# EAGLE design GPS_Tracker (EAGLE 6.5.0)
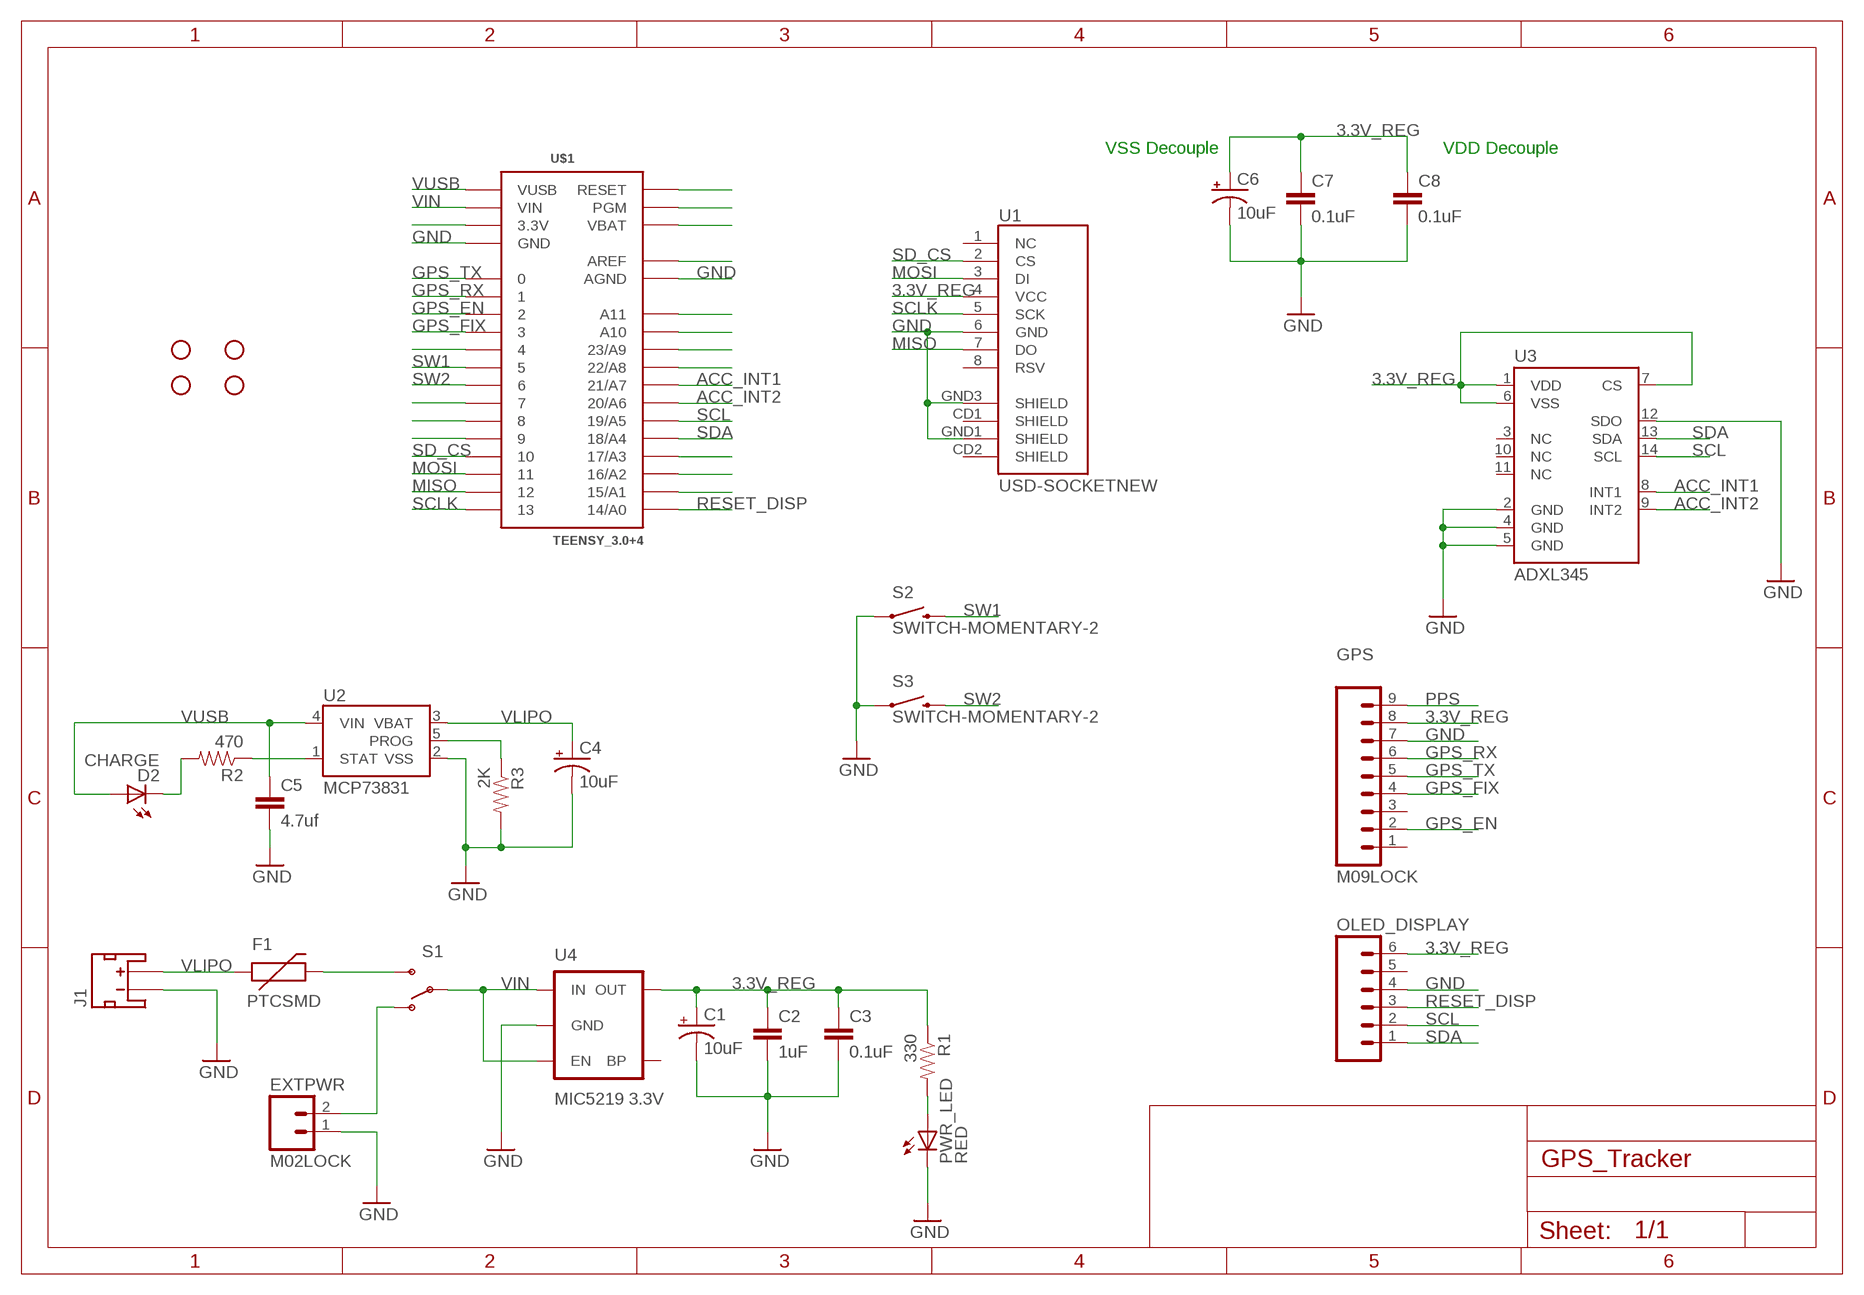
[diagram p0: schematic, sheet 1]

## Parts
C1  10uF  CAP_POL1206  [EIA3216]
C2  1uF  CAP0402-CAP  [0402-CAP]
C3  0.1uF  CAP0402-CAP  [0402-CAP]
C4  10uF  CAP_POL1206  [EIA3216]
C5  4.7uf  CAP0402-CAP  [0402-CAP]
C6  10uF  CAP_POL1206  [EIA3216]
C7  0.1uF  CAP0402-CAP  [0402-CAP]
C8  0.1uF  CAP0402-CAP  [0402-CAP]
D2  CHARGE  LED-YELLOW0603  [LED-0603]
EXTPWR  M02LOCK  [1X02_LOCK]
F1  PTCSMD  [PTC-1206]
GPS  M09LOCK  [1X09_LOCK]
J1  JST_2MM_MALE  [JST-2-SMD]
OLED_DISPLAY  M06LOCK  [1X06_LOCK]
PWR_LED  RED  LED-RED0603  [LED-0603]
R1  330  RESISTOR0402-RES  [0402-RES]
R2  470  RESISTOR0402-RES  [0402-RES]
R3  2K  RESISTOR0402-RES  [0402-RES]
S1  SWITCH-SPDTSMD  [AYZ0202]
S2  SWITCH-MOMENTARY-2  [TACTILE_SWITCH_TALL]
S3  SWITCH-MOMENTARY-2  [TACTILE_SWITCH_TALL]
STANDOFF1  STAND-OFF  [STAND-OFF]
STANDOFF2  STAND-OFF  [STAND-OFF]
STANDOFF3  STAND-OFF  [STAND-OFF]
STANDOFF4  STAND-OFF  [STAND-OFF]
U1  USD-SOCKETNEW  [MICRO-SD-SOCKET-PP]
U2  MCP73831  [SOT23-5]
U3  ADXL345  [LGA14]
U4  MIC5219 3.3V  V_REG_MIC52193.3V  [SOT23-5]
U$1  TEENSY_3.0+4  [TEENSY_3.0+4]

## Nets
3.3V_REG: C1.A(+) C2.1 C3.1 C6.A(+) C7.1 C8.1 GPS.8 OLED_DISPLAY.6 R1.1 U1.4(VCC) U3.1(VDD) U3.6(VSS) U3.7(CS) U4.5(OUT)
ACC_INT1: U3.8(INT1) U$1.21/A7
ACC_INT2: U3.9(INT2) U$1.20/A6
GND: C1.C(-) C2.2 C3.2 C4.C(-) C5.2 C6.C(-) C7.2 C8.2 EXTPWR.1 GPS.7 J1.1(-) OLED_DISPLAY.4 PWR_LED.C R3.2 S2.A2 S3.A2 U1.6(GND) U1.GND1(SHIELD) U1.GND3(SHIELD) U2.2(VSS) U3.2(GND) U3.4(GND) U3.5(GND) U3.12(SDO) U4.2(GND) U$1.AGND U$1.GND U$1.GND1(GND)
GPS_EN: GPS.2 U$1.2
GPS_FIX: GPS.4 U$1.3
GPS_RX: GPS.6 U$1.1
GPS_TX: GPS.5 U$1.0
MISO: U1.7(DO) U$1.12
MOSI: U1.3(DI) U$1.11
N$1: D2.C R2.2
N$2: F1.2 S1.3(S)
N$3: EXTPWR.2 S1.1(O)
N$4: U$1.3.3V U$1.3.3V1(3.3V)
N$6: PWR_LED.A R1.2
N$7: R2.1 U2.1(STAT)
N$9: R3.1 U2.5(PROG)
N$13: U$1.4
N$16: U$1.7
N$17: U$1.8
N$18: U$1.9
N$24: U$1.15/A1
N$25: U$1.16/A2
N$26: U$1.17/A3
N$31: U$1.22/A8
N$32: U$1.23/A9
N$33: U$1.A10
N$34: U$1.A11
N$36: U$1.AREF
N$37: U$1.VBAT
N$38: U$1.PGM
N$39: U$1.RESET
PPS: GPS.9
RESET_DISP: OLED_DISPLAY.3 U$1.14/A0
SCL: OLED_DISPLAY.2 U3.14(SCL) U$1.19/A5
SCLK: U1.5(SCK) U$1.13
SD_CS: U1.2(CS) U$1.10
SDA: OLED_DISPLAY.1 U3.13(SDA) U$1.18/A4
SW1: S2.B2 U$1.5
SW2: S3.B2 U$1.6
VIN: S1.2(P) U4.1(IN) U4.3(EN) U$1.VIN
VLIPO: C4.A(+) F1.1 J1.2(+) U2.3(VBAT)
VUSB: C5.1 D2.A U2.4(VIN) U$1.VUSB
Unconnected: GPS.1 GPS.3 J1.NC1(PAD1) J1.NC2(PAD2) OLED_DISPLAY.5 U1.1(NC) U1.8(RSV) U1.CD1(SHIELD) U1.CD2(SHIELD) U3.3(NC) U3.10(NC) U3.11(NC) U4.4(BP)

## Notes on the sheet
- VSS Decouple | VDD Decouple

## Library data of the parts
C1 C4 C6 = SparkFun-Passives:CAP_POL: Capacitor Polarized These are standard SMD and PTH capacitors. Normally 10uF, 47uF, and 100uF in electrolytic and tantalum varieties. Always verify the external diameter of the through hole cap, it varies with capacity, voltage, and manufacturer. The EIA devices should be standard.
C2 C3 C5 C7 C8 = SparkFun-Passives:CAP: Capacitor Standard 0603 ceramic capacitor, and 0.1" leaded capacitor.
D2 = SparkFun-LED:LED-YELLOW: Yellow SMD LEDs LilyPad 1206- DIO-09909 0603- DIO-09003; PROD_ID: DIO-09003
EXTPWR = SparkFun-Connectors:M02: Standard 2-pin 0.1" header. Use with - straight break away headers ( PRT-00116) - right angle break away headers (PRT-00553) - swiss pins (PRT-00743) - machine pins (PRT-00117) - female headers (PRT-00115) Molex polarized connector foot print use with: PRT-08233 with associated crimp pins and housings. 2.54_SCREWTERM for use with PRT-10571. 3.5mm Screw Terminal footprints for PRT-08084 5mm Screw Terminal footprints for use with PRT-08433
F1 = SparkFun-PowerIC:PTC: Resettable Fuse PTC Resettable Fuse. Spark Fun Electronics SKU : COM-08357; PROD_ID: RES-11150
GPS = SparkFun-Connectors:M09: Header 9 Standard 9-pin 0.1" header. Use with straight break away headers (SKU : PRT-00116), right angle break away headers (PRT-00553), swiss pins (PRT-00743), machine pins (PRT-00117), and female headers (PRT-00115).
J1 = SparkFun-Connectors:JST_2MM_MALE: Mates to single-cell LiPo batteries. CONN-08352; PROD_ID: CONN-08352
OLED_DISPLAY = SparkFun-Connectors:M06: Header 6 Standard 6-pin 0.1" header. Use with straight break away headers (SKU : PRT-00116), right angle break away headers (PRT-00553), swiss pins (PRT-00743), machine pins (PRT-00117), and female headers (PRT-00115). Molex polarized connector foot print use with SKU : PRT-08094 with associated crimp pins and housings. NOTES ON THE VARIANTS LOCK and LOCK_LONGPADS... This footprint was designed to help hold the alignment of a through-hole component (i.e. 6-pin header) while soldering it into place. You may notice that each hole has been shifted either up or down by 0.005 of an inch from it's more standard position (which is a perfectly straight line). This slight alteration caused the pins (the squares in the middle) to touch the edges of the holes. Because they are alternating, it causes a "brace" to hold the component in place. 0.005 has proven to be the perfect amount of "off-center" position when using our standard breakaway headers. Although looks a little odd when you look at the bare footprint, once you have a header in there, the alteration is very hard to notice. Also,if you push a header all the way into place, it is covered up entirely on the bottom side. This idea of altering the position of holes to aid alignment will be further integrated into the Sparkfun Library for other footprints. It can help hold any component with 3 or more connection pins.
PWR_LED = SparkFun-LED:LED-RED: Assorted Red LEDs LilyPad 1206- DIO-09912 1206- DIO-00809 0603- DIO-00819; PROD_ID: DIO-00819
R1-R3 = SparkFun-Passives:RESISTOR: Resistor Basic schematic elements and footprints for 0603, 1206, and PTH resistors.
S1 = SparkFun-Electromechanical:SWITCH-SPDT: SPDT Switch Simple slide switch, Spark Fun Electronics SKU : COM-00102 DPDT SMT slide switch, AYZ0202, SWCH-08179; PROD_ID: SWCH-08179
S2 S3 = SparkFun-Electromechanical:SWITCH-MOMENTARY-2: Various NO switches- pushbuttons, reed, etc
STANDOFF1-STANDOFF4 = SparkFun-Electromechanical:STAND-OFF: #4 Stand Off This is the mechanical footprint for a #4 phillips button head screw. Use the keepout ring to avoid running the screw head into surrounding components. SKU : PRT-00447
U1 = SparkFun-Connectors:USD-SOCKET: microSD Socket Push-push type uSD socket. Schematic element and footprint production proven. Spark Fun Electronics SKU : PRT-00127. tDoc lines correctly indicate media card edge positions when inserting (unlocked, locked, depressed).
U2 = SparkFun-PowerIC:MCP73831: Miniature single cell, fully integrated Li-Ion, Li-polymer charge management controller http://ww1.microchip.com/downloads/en/DeviceDoc/21984a.pdf IC-09995; PROD_ID: IC-09995
U3 = SparkFun-Sensors:ADXL345: 3-axis SPI/I2C 2/4/8/16g accelerometer
U4 = SparkFun-PowerIC:V_REG_MIC5219: V_REG MIC5219 Standard 500mA LDO voltage regulator in SOT-23 layout. Micrel part MIC5219. BP (by-pass) pin is used to lower output noise with 470pF cap, may be left open.; PROD_ID: VREG-09872
U$1 = Teensy3.0:TEENSY_3.0+4: Teensy 3.0 board, showing all pins that are easily acessible. See 'AllAnalogPins" and 'AllPins' packages for additional pin holes, as needed. The 'Basic' package has fewer pins.

## Board
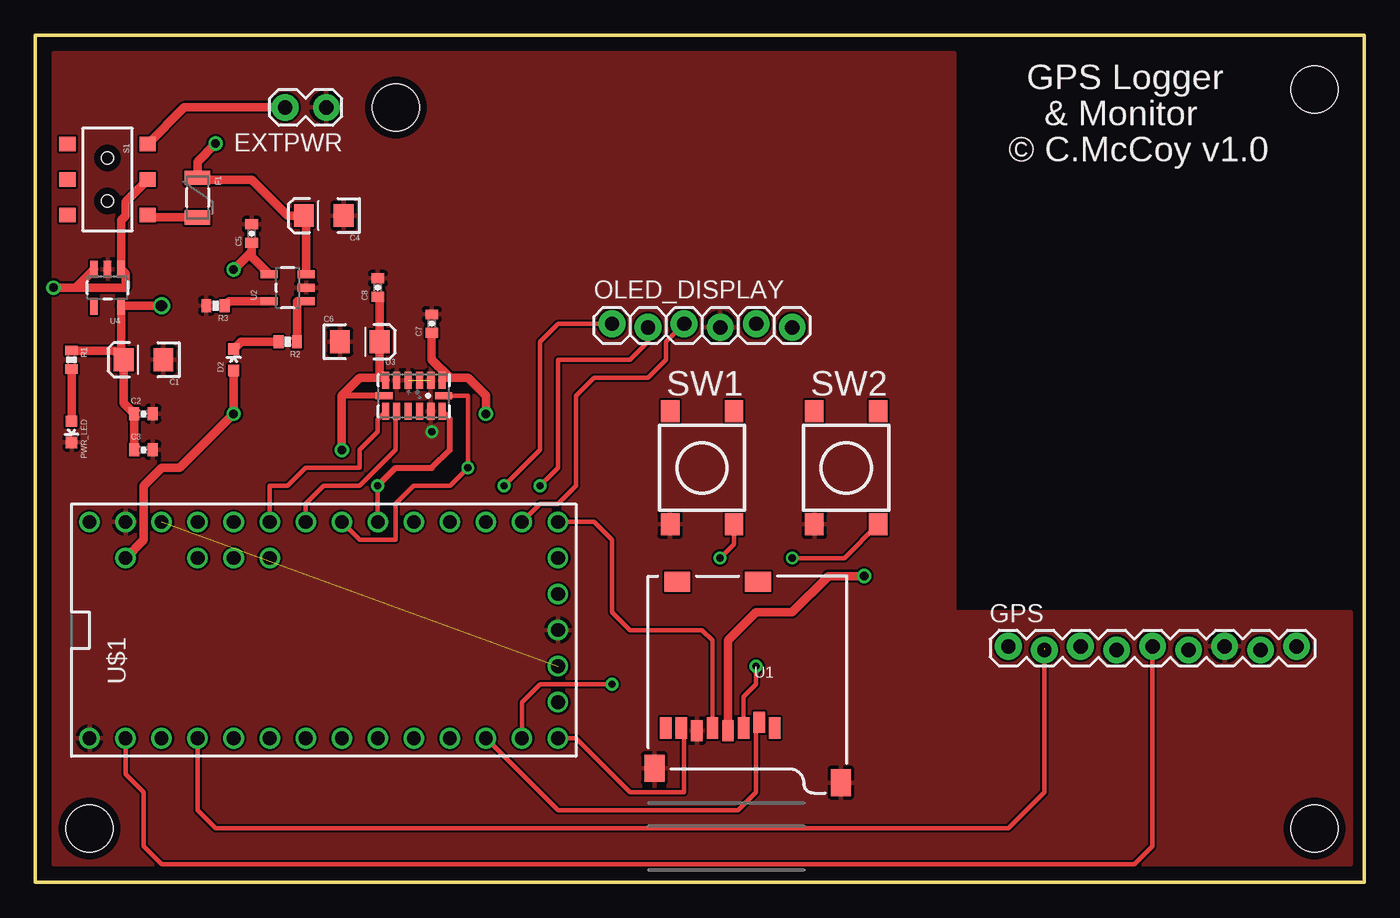
[diagram p1: board, top side]
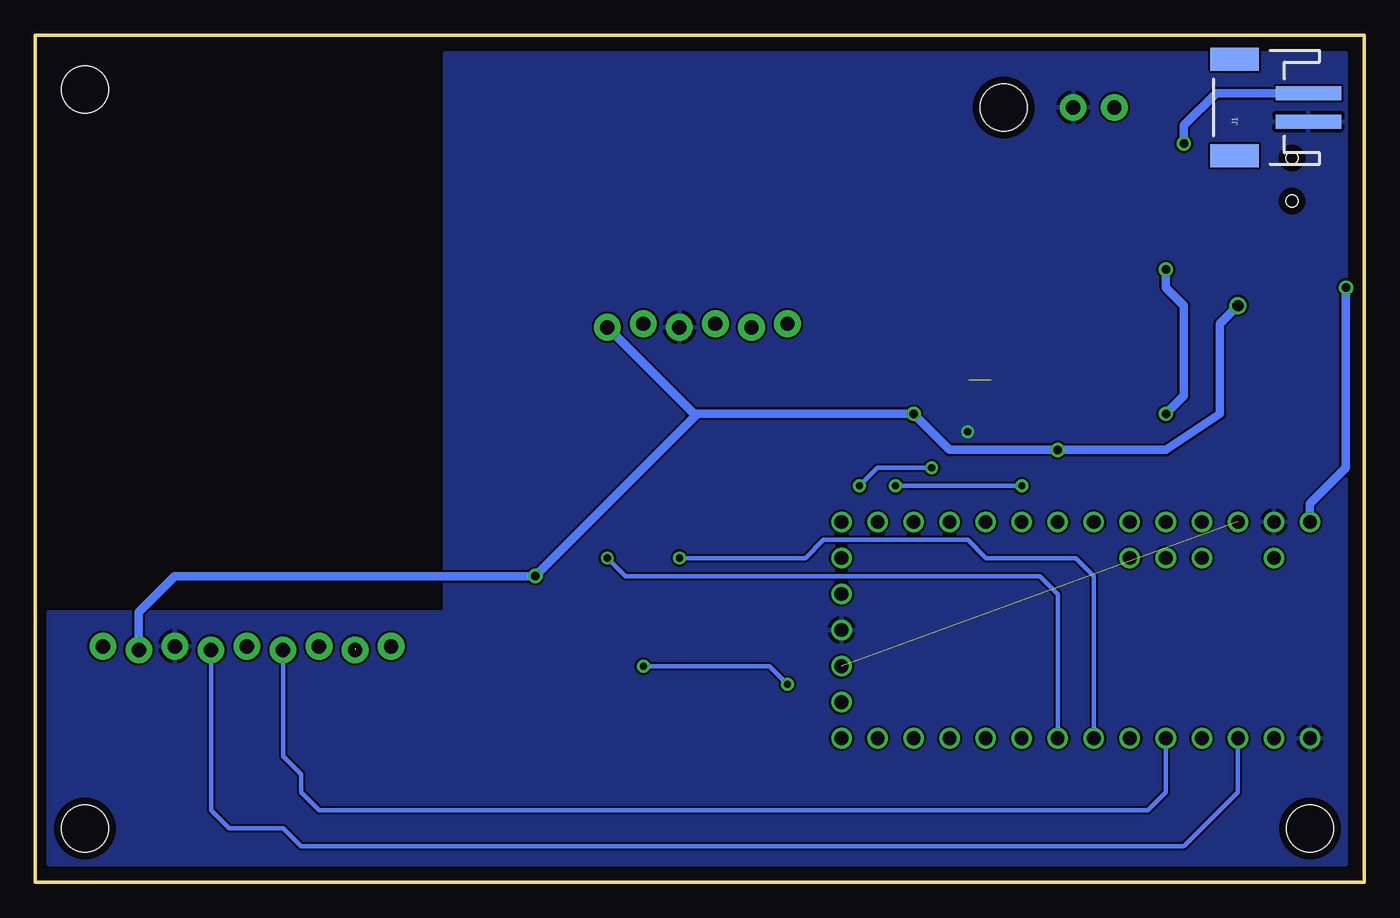
[diagram p2: board, bottom side, seen from below]

Size 93.65 x 59.68 mm. Coordinates in mm from the lower left corner, seen from the top.
Outline: 93.65,0 93.65,59.68 0,59.68 0,0 93.65,0
Copper layers (1*16): Top 0.0178mm / dielectric 59mil / Bottom 0.0178mm
Design rules "SSC-EAGLE-2Lyr_v1.0.0.3": minimum track width 6mil, minimum drill 14mil, track to track 6mil, track to pad 6mil, pad to pad 6mil, via to via 6mil, smd to smd 6mil, copper to edge 20mil, drill to drill 16mil, minimum pad ring 8mil, minimum via ring 8mil, stop-mask expansion 3mil, vias tented up to drill 0mil, thermal gap 10mil
tKeepout: area 66.4,12.7 to 91.4,47.7

### Footprints (pad centres in the part's own frame; a part is rotated, then mirrored left to right if it is on the bottom)
EIA3216 = smd 1.4 x 1.6: A 1.4,0; C -1.4,0
0402-CAP = smd 0.7 x 0.9: 1 -0.65,0; 2 0.65,0
LED-0603 = smd 0.8 x 0.8: A 0,-0.75; C 0,0.75
1X02_LOCK = drill 1.016 pad 1.88: 1 -0.178,0; 2 2.718,0
PTC-1206 = smd 1 x 1.8: 1 -1.4,0; 2 1.4,0
1X09_LOCK = drill 1.016 pad 1.88: 1 0,0.127; 2 2.54,-0.127; 3 5.08,0.127; 4 7.62,-0.127; 5 10.16,0.127; 6 12.7,-0.127; 7 15.24,0.127; 8 17.78,-0.127; 9 20.32,0.127
JST-2-SMD = smd 1 x 4.6: 1 -1,-3.7; 2 1,-3.7 | smd 1.6 x 3.4: NC1 -3.4,1.5; NC2 3.4,1.5
1X06_LOCK = drill 1.016 pad 1.88: 1 0,0; 2 2.54,-0.254; 3 5.08,0; 4 7.62,-0.254; 5 10.16,0; 6 12.7,-0.254
0402-RES = smd 0.7 x 0.9: 1 -0.65,0; 2 0.65,0
AYZ0202 = smd 1 x 1.15: 1 -2.5,2.825; 2 0,2.825; 3 2.5,2.825; 4 -2.5,-2.825; 5 0,-2.825; 6 2.5,-2.825 | hole 0.85: 1.5,0; -1.5,0
TACTILE_SWITCH_TALL = smd 1.55 x 1.3: A1 -3.975,-2.25; A2 3.975,-2.25; B1 -3.975,2.25; B2 3.975,2.25
STAND-OFF = hole 3.302: 0,0
MICRO-SD-SOCKET-PP = smd 0.8 x 1.5: 1 -8.94,10.7; 2 -7.84,10.3; 3 -6.74,10.7; 4 -5.64,10.9; 5 -4.54,10.7; 6 -3.44,10.9; 7 -2.34,10.7; 8 -1.24,10.7 | smd 1.8 x 1.4: CD1 -2.05,0.4; CD2 -7.75,0.4 | smd 1.4 x 1.9: GND1 -13.6,14.55; GND3 -0.45,13.55
SOT23-5 = smd 0.55 x 1.2: 1 -0.95,-1.3; 2 0,-1.3; 3 0.95,-1.3; 4 0.95,1.3; 5 -0.95,1.3
LGA14 = smd 0.5 x 1.2: 1 2,1.1; 2 1.2,1.1; 3 0.4,1.1; 4 -0.4,1.1; 5 -1.2,1.1; 6 -2,1.1; 8 -2,-1.1; 9 -1.2,-1.1; 10 -0.4,-1.1; 11 0.4,-1.1; 12 1.2,-1.1; 13 2,-1.1 | smd 1.2 x 0.5: 7 -2.1,0; 14 2.1,0
TEENSY_3.0+4 = drill 0.965: 0 -7.62,13.97; 1 -7.62,11.43; 2 -7.62,8.89; 3 -7.62,6.35; 3.3V 7.62,11.43; 3.3V1 -2.54,-16.51; 4 -7.62,3.81; 5 -7.62,1.27; 6 -7.62,-1.27; 7 -7.62,-3.81; 8 -7.62,-6.35; 9 -7.62,-8.89; 10 -7.62,-11.43; 11 -7.62,-13.97; 12 -7.62,-16.51; 13 7.62,-16.51; 14/A0 7.62,-13.97; 15/A1 7.62,-11.43; 16/A2 7.62,-8.89; 17/A3 7.62,-6.35; 18/A4 7.62,-3.81; 19/A5 7.62,-1.27; 20/A6 7.62,1.27; 21/A7 7.62,3.81; 22/A8 7.62,6.35; 23/A9 7.62,8.89; A10 5.08,6.35; A11 5.08,3.81; AGND 7.62,13.97; AREF 5.08,8.89; GND -7.62,16.51; GND1 0,-16.51; PGM 2.54,-16.51; RESET 5.08,-16.51; VBAT -5.08,-16.51; VIN 7.62,16.51; VUSB 5.08,13.97

### Placement (x,y rotation side)
C1  7.62,36.83 180 top
C2  7.62,33.02 0 top
C3  7.62,30.48 0 top
C4  20.32,46.99 180 top
C5  15.24,45.72 90 top
C6  22.86,38.1 0 top
C7  27.94,39.37 90 top
C8  24.13,41.91 90 top
D2  13.97,36.83 0 top
EXTPWR  20.32,54.61 180 top
F1  11.43,48.26 270 top
GPS  68.58,16.51 0 top
J1  7.62,54.61 90 bottom
OLED_DISPLAY  40.64,39.37 0 top
PWR_LED  2.54,31.75 180 top
R1  2.54,36.83 270 top
R2  17.78,38.1 180 top
R3  12.7,40.64 180 top
S1  5.08,49.53 270 top
S2  46.99,29.21 270 top
S3  57.15,29.21 270 top
STANDOFF1  3.81,3.81 0 top
STANDOFF2  90.17,55.88 0 top
STANDOFF3  90.17,3.81 0 top
STANDOFF4  25.4,54.61 0 top
U1  43.18,21.59 180 top
U2  17.78,41.91 90 top
U3  26.67,34.29 0 top
U4  5.08,41.91 180 top
U$1  20.32,17.78 90 top

### Tracks (layer width: path | path; a pad name or v marks a point on that pad's centre or on a via)
3.3V_REG  (via drill 0.6, 0.8)
  Top 0.406: U3.7 21.59,34.29
  Top 0.61: C1.A 6.03,37.02 U4.5 6.06,40.64 v8.89,40.64 | R1.1 5.57,37.48 C1.A | C1.A 6.22,33.77 C2.1 C3.1 | v21.59,30.48 21.59,34.29 22.86,35.56 24.26,35.56 | U3.6 24.5,35.56 24.26,35.56 | 29.21,35.56 30.48,35.56 31.75,34.29 v31.75,33.02 | 29.21,35.56 28.84,35.56 U3.1 | v58.42,21.59 55.88,21.59 53.34,19.05 50.8,19.05 48.82,17.07 U1.4 | C7.1 27.94,36.83 29.21,35.56 | 24.26,35.56 C6.A 24.26,41.26 C8.1
  Bottom 0.61: v8.89,40.64 10.16,39.37 10.16,33.02 13.97,30.48 v21.59,30.48 29.21,30.48 v31.75,33.02 46.99,33.02 | 46.99,33.02 47.24,33.02 OLED_DISPLAY.6 | GPS.8 86.36,19.05 83.82,21.59 v58.42,21.59 46.99,33.02
ACC_INT1
  Top 0.305: U$1.21/A7 16.51,27.94 17.78,27.94 19.05,29.21 22.86,29.21 22.86,30.48 24.13,31.75 24.13,32.65 U3.8
ACC_INT2
  Top 0.305: U$1.20/A6 19.05,26.67 20.32,27.94 22.86,27.94 25.4,30.48 25.4,33.12 U3.9
GND  (via drill 0.5)  (1 unrouted)
  other vias: 27.94,31.75
  pour Bottom: 1.27,58.42 64.77,58.42 64.77,19.05 92.71,19.05 92.71,1.27 1.27,1.27
  pour Top: 1.27,58.42 64.77,58.42 64.77,19.05 91.44,19.05 92.71,19.05 92.71,1.27 1.27,1.27
GPS_EN  (1 unrouted)
  Top 0.305: U$1.2 11.43,5.08 12.7,3.81 68.58,3.81 71.12,6.35 71.12,16.51
GPS_FIX
  Bottom 0.305: U$1.3 13.97,6.35 15.24,5.08 73.66,5.08 74.93,6.35 74.93,7.62 76.2,8.89 GPS.4
GPS_RX
  Bottom 0.305: U$1.1 8.89,6.35 12.7,2.54 74.93,2.54 76.2,3.81 80.01,3.81 81.28,5.08 GPS.6
GPS_TX
  Top 0.305: U$1.0 6.35,7.62 7.62,6.35 7.62,2.54 8.89,1.27 77.47,1.27 78.74,2.54 GPS.5
MISO
  Top 0.305: U$1.12 38.1,10.16 41.91,6.35 45.72,6.35 45.72,10.69 U1.7
MOSI  (via drill 0.5)
  Top 0.305: U$1.11 34.29,12.7 35.56,13.97 v40.64,13.97 | v50.8,15.24 50.8,13.97 49.92,13.09 U1.3
  Bottom 0.305: v40.64,13.97 41.91,15.24 v50.8,15.24
N$1
  Top 0.61: D2.C 14.49,38.1 R2.2
N$2
  Top 0.61: F1.2 8.07,46.86 S1.3
N$3
  Top 0.61: EXTPWR.2 10.48,54.61 S1.1
N$4  (1 unrouted)
N$6
  Top 0.61: R1.2 PWR_LED.A
N$7
  Top 0.61: U2.1 18.43,40.96 R2.1
N$9
  Top 0.61: R3.1 13.67,40.96 U2.5
RESET_DISP
  Top 0.305: U$1.14/A0 35.56,26.67 36.83,26.67 38.1,27.94 38.1,34.29 39.37,35.56 43.18,35.56 44.45,36.83 44.45,38.1 OLED_DISPLAY.3
SCL  (via drill 0.5)
  Top 0.305: OLED_DISPLAY.2 43.18,38.1 41.91,36.83 36.83,36.83 36.83,29.21 v35.56,27.94 | U$1.19/A5 22.86,24.13 25.4,24.13 25.4,26.67 26.67,27.94 29.21,27.94 v30.48,29.21 30.48,34.29 U3.14
  Bottom 0.305: v35.56,27.94 34.29,29.21 v30.48,29.21
SCLK
  Top 0.305: U$1.13 39.37,25.4 40.64,24.13 40.64,19.05 41.91,17.78 46.99,17.78 47.72,17.05 U1.5
SD_CS
  Top 0.305: U$1.10 36.83,5.08 49.53,5.08 50.8,6.35 50.8,11.07 U1.2
SDA  (via drill 0.5)
  Top 0.305: v24.13,27.94 U$1.18/A4 | OLED_DISPLAY.1 36.83,39.37 35.56,38.1 35.56,30.48 v33.02,27.94
  Top 0.406: v24.13,27.94 25.4,29.21 27.94,29.21 29.21,30.48 29.21,32.65 U3.13
  Bottom 0.305: v33.02,27.94 v24.13,27.94
SW1  (via drill 0.5)
  Top 0.305: S2.B2 49.24,23.84 v48.26,22.86
  Bottom 0.305: v48.26,22.86 39.37,22.86 38.1,24.13 27.94,24.13 26.67,22.86 20.32,22.86 19.05,21.59 U$1.5
SW2  (via drill 0.5)
  Top 0.305: v53.34,22.86 57.02,22.86 S3.B2
  Bottom 0.305: U$1.6 21.59,20.32 22.86,21.59 52.07,21.59 v53.34,22.86
VIN  (via drill 0.6)
  Top 0.61: U4.3 2.83,41.91 | 2.83,41.91 v1.27,41.91 | 2.83,41.91 6.35,41.91 6.35,42.89 U4.1 6.03,46.67 6.35,46.99 6.35,47.98 S1.2
  Bottom 0.61: U$1.VIN 3.81,26.67 1.27,29.21 v1.27,41.91
VLIPO  (via drill 0.6)
  Top 0.61: v12.7,52.07 11.43,50.8 F1.1 11.43,49.53 15.24,49.53 17.78,46.99 C4.A 19.08,46.83 U2.3
  Bottom 0.61: v12.7,52.07 12.7,53.34 10.43,55.61 J1.2
VUSB  (via drill 0.6)
  Top 0.61: U$1.VUSB 7.62,24.13 7.62,27.94 8.89,29.21 10.16,29.21 v13.97,33.02 D2.A | v13.97,43.18 15.24,44.45 | 15.24,44.45 C5.1 | U2.4 15.24,44.1 15.24,44.45
  Bottom 0.61: v13.97,33.02 12.7,34.29 12.7,40.64 13.97,41.91 v13.97,43.18

### Text on the board
tNames: GPS Logger | & Monitor | © C.McCoy v1.0 | SW1 | SW2